# Altium schematic sheet ET-USB.SchDoc
size A4
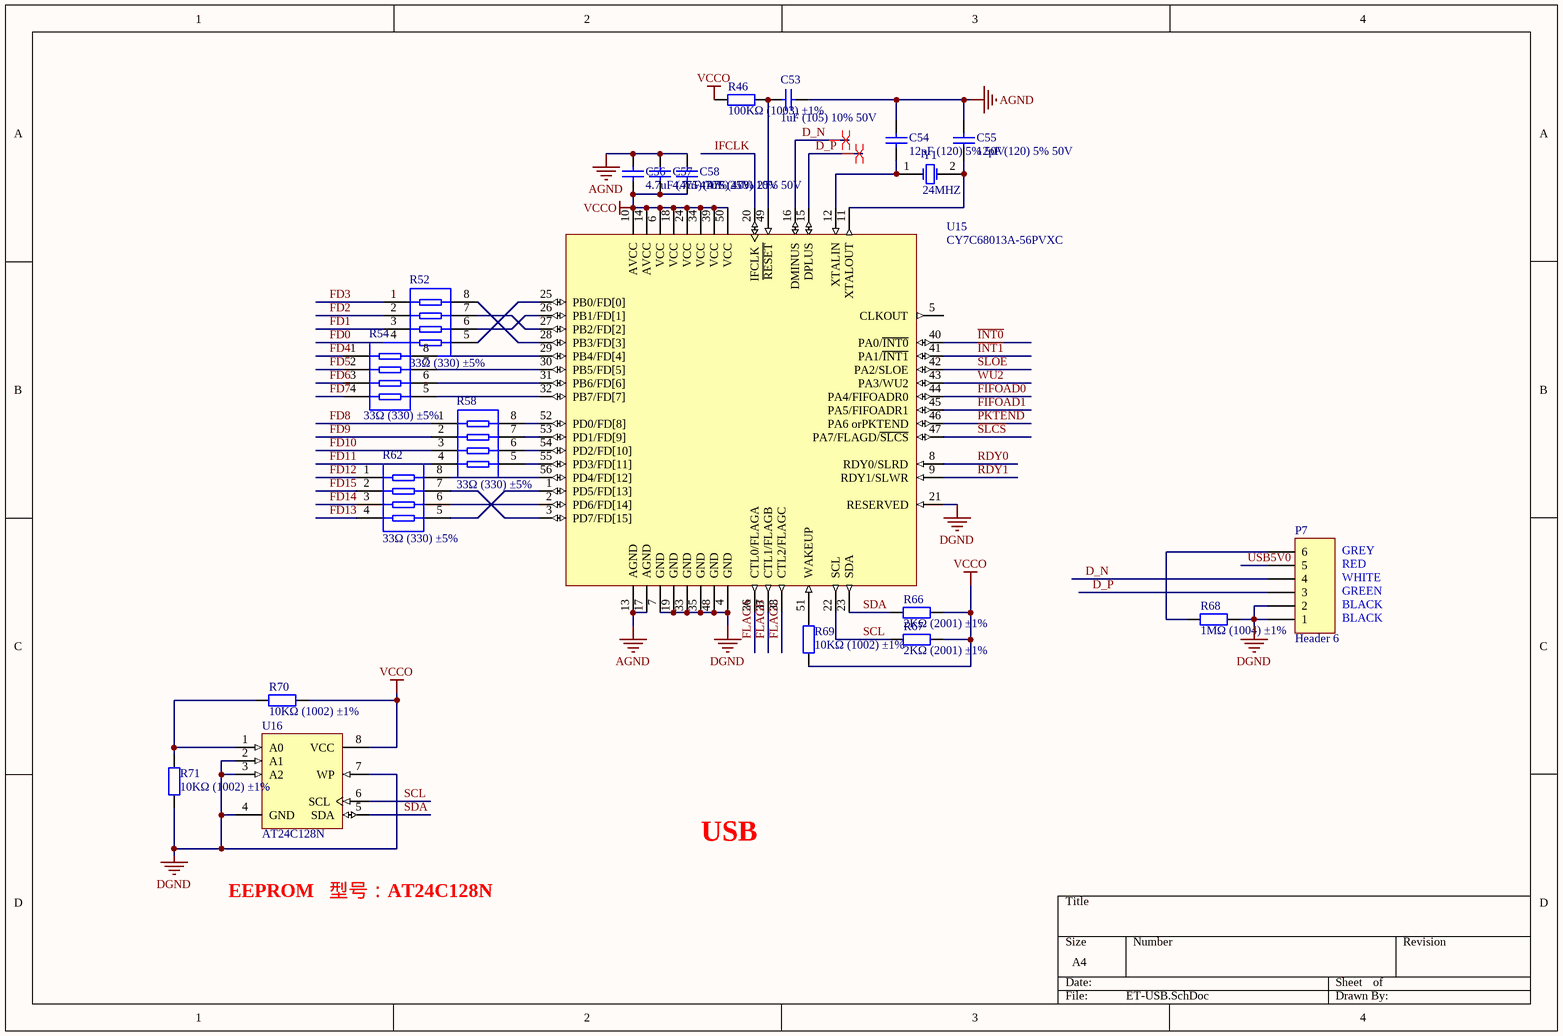
[diagram p0: ET-USB.SchDoc]

## Parts
C53  1uF (105) 10% 50V  [LC-0805_C]
C54  12pF (120) 5% 50V  [LC-0805_C]
C55  12pF (120) 5% 50V  [LC-0805_C]
C56  4.7uF (475) 10% 25V  [LC-0805_C]
C57  4.7uF (475) 10% 25V  [LC-0805_C]
C58  47nF (473) 10% 50V  [LC-0805_C]
P7  Header 6  [HDR1X6]
R46  100KΩ (1003) ±1%  [LC-0805_R]
R52  33Ω (330) ±5%  [LC-0402_Rx4]
R54  33Ω (330) ±5%  [LC-0402_Rx4]
R58  33Ω (330) ±5%  [LC-0402_Rx4]
R62  33Ω (330) ±5%  [LC-0402_Rx4]
R66  2KΩ (2001) ±1%  [LC-0805_R]
R67  2KΩ (2001) ±1%  [LC-0805_R]
R68  1MΩ (1004) ±1%  [LC-0805_R]
R69  10KΩ (1002) ±1%  [LC-0805_R]
R70  10KΩ (1002) ±1%  [LC-0805_R]
R71  10KΩ (1002) ±1%  [LC-0805_R]
U15  CY7C68013A-56PVXC  [O56_N]
U16  AT24C128N  [8P3]
Y1  24MHZ  [XTAL5]

## Nets
AGND: C53.2 C54.2 C55.2 C56.2 C57.2 C58.2 U15.13(AGND) U15.17(AGND)
DGND: P7.1 P7.2 R68.2 R71.1 U15.4(GND) U15.7(GND) U15.19(GND) U15.21(RESERVED) U15.33(GND) U15.35(GND) U15.48(GND) U16.2(A1) U16.3(A2) U16.4(GND) U16.7(WP)
VCCO: C56.1 C57.1 C58.1 R46.1 R66.2 R67.2 R69.1 R70.2 U15.6(VCC) U15.10(AVCC) U15.14(AVCC) U15.18(VCC) U15.24(VCC) U15.34(VCC) U15.39(VCC) U15.50(VCC) U16.8(VCC)
~{INT0}: U15.40(PA0/~{INT0})
~{INT1}: U15.41(PA1/~{INT1})
~{SLCS}: U15.47(PA7/FLAGD/~{SLCS})
D_N: P7.4 U15.16(DMINUS)
D_P: P7.3 U15.15(DPLUS)
FD0: R52.4
FD1: R52.3
FD2: R52.2
FD3: R52.1
FD4: R54.1
FD5: R54.2
FD6: R54.3
FD7: R54.4
FD8: R58.1
FD9: R58.2
FD10: R58.3
FD11: R58.4
FD12: R62.1
FD13: R62.4
FD14: R62.3
FD15: R62.2
FIFOAD0: U15.44(PA4/FIFOADR0)
FIFOAD1: U15.45(PA5/FIFOADR1)
FLAGA: U15.36(CTL0/FLAGA)
FLAGB: U15.37(CTL1/FLAGB)
FLAGC: U15.38(CTL2/FLAGC)
IFCLK: U15.20(IFCLK)
PKTEND: U15.46(PA6_orPKTEND)
RDY0: U15.8(RDY0/SLRD)
RDY1: U15.9(RDY1/SLWR)
SCL: R67.1 U15.22(SCL) U16.6(SCL)
SDA: R66.1 U15.23(SDA) U16.5(SDA)
SLOE: U15.42(PA2/SLOE)
USB5V0: P7.5
WU2: U15.43(PA3/WU2)
NetC53_1: C53.1 R46.2 U15.49(~{RESET})
NetC54_1: C54.1 U15.12(XTALIN) Y1.1(OSC1)
NetC55_1: C55.1 U15.11(XTALOUT) Y1.2(OSC2)
NetP7_6: P7.6 R68.1
NetR52_5: R52.5 U15.25(PB0/FD[0])
NetR52_6: R52.6 U15.26(PB1/FD[1])
NetR52_7: R52.7 U15.27(PB2/FD[2])
NetR52_8: R52.8 U15.28(PB3/FD[3])
NetR54_5: R54.5 U15.32(PB7/FD[7])
NetR54_6: R54.6 U15.31(PB6/FD[6])
NetR54_7: R54.7 U15.30(PB5/FD[5])
NetR54_8: R54.8 U15.29(PB4/FD[4])
NetR58_5: R58.5 U15.55(PD3/FD[11])
NetR58_6: R58.6 U15.54(PD2/FD[10])
NetR58_7: R58.7 U15.53(PD1/FD[9])
NetR58_8: R58.8 U15.52(PD0/FD[8])
NetR62_5: R62.5 U15.1(PD5/FD[13])
NetR62_6: R62.6 U15.2(PD6/FD[14])
NetR62_7: R62.7 U15.3(PD7/FD[15])
NetR62_8: R62.8 U15.56(PD4/FD[12])
NetR69_2: R69.2 U15.51(WAKEUP)
NetR70_1: R70.1 R71.2 U16.1(A0)

Not connected (* = marked no-connect by the designer): U15 5(CLKOUT)

## Layout directives
differential pair: D_N, D_P

## Notes on the sheet
- USB
- EEPROM   型号：AT24C128N
- Labels drawn without touching a wire or pin: BLACK, GREEN, GREY, RED, WHITE

## Library data of the parts
C53 = 0805 1uF (105) 10% 50V: 贴片电容; ComponentLink1Description: 供应商链接; ComponentLink1URL: http://www.szlcsc.com/product/details_29074.html; Package: 0805; Supplier: LC; SuppliersPartNumber: C28323
C54 C55 = 0805 12pF (120) 5% 50V: 贴片电容; ComponentLink1Description: 供应商链接; ComponentLink1URL: http://www.szlcsc.com/product/details_2144.html; Package: 0805; Supplier: LC; SuppliersPartNumber: C1792
C56 C57 = 0805 4.7uF (475) 10% 25V: 贴片电容; ComponentLink1Description: 供应商链接; ComponentLink1URL: http://www.szlcsc.com/product/details_2131.html; Package: 0805; Supplier: LC; SuppliersPartNumber: C1779
C58 = 0805 47nF (473) 10% 50V: 贴片电容; ComponentLink1Description: 供应商链接; ComponentLink1URL: http://www.szlcsc.com/product/details_54150.html; Package: 0805; Supplier: LC; SuppliersPartNumber: C53134
P7 = Header 6: Header, 6-Pin; LatestRevisionDate: 17-Jul-2002; LatestRevisionNote: Re-released for DXP Platform.; Publisher: Altium Limited
R46 = 0805 100KΩ (1003) 1%: 贴片电阻; ComponentLink1Description: 供应商链接; ComponentLink1URL: http://www.szlcsc.com/product/details_18095.html; Package: 0805; Supplier: LC; SuppliersPartNumber: C17407
R52 R54 R58 R62 = 0402*4 33Ω (330) 5%: 贴片排阻; ComponentLink1Description: 供应商链接; ComponentLink1URL: http://www.szlcsc.com/product/details_26244.html; Package: 0402*4; Supplier: LC; SuppliersPartNumber: C25501
R66 R67 = 0805 2KΩ (2001) 1%: 贴片电阻; ComponentLink1Description: 供应商链接; ComponentLink1URL: http://www.szlcsc.com/product/details_18292.html; Package: 0805; Supplier: LC; SuppliersPartNumber: C17604
R68 = 0805 1MΩ (1004) 1%: 贴片电阻; ComponentLink1Description: 供应商链接; ComponentLink1URL: http://www.szlcsc.com/product/details_18202.html; Package: 0805; Supplier: LC; SuppliersPartNumber: C17514
R69-R71 = 0805 10KΩ (1002) 1%: 贴片电阻; ComponentLink1Description: 供应商链接; ComponentLink1URL: http://www.szlcsc.com/product/details_18102.html; Package: 0805; Supplier: LC; SuppliersPartNumber: C17414
U15 = CY7C68013A-56PVXC: EZ-USB FX2LP USB Microcontroller Ideal for Non-Battery Powered Applications,16K RAM, 24 I/Os, 56-Pin SSOP, Pb-Free, Commercial Grade; Published: 16-Dec-2005; LatestRevisionDate: 20-Nov-2009; LatestRevisionNote: IPC-7351 Footprint Added.; DatasheetVersion: rev.J, Sep-2005; PackageVersion: Feb-2005; PackageReference: O56; Publisher: Altium Limited; PackageDescription: 56-Pin Small Outline Package 0.635 mm Pitch; Code_JEDEC: MO-118-AB; Code_IPC: SOP635P1035-56; ComponentLink1Description: Manufacturer Link; ComponentLink1URL: http://www.cypress.com/portal/server.pt; ComponentLink2Description: Datasheet; ComponentLink2URL: http://www.cypress.com/portal/server.pt/gateway/PTARGS_0_2_1524_209_259_43/http%3B/sjapp20.mis.cypress.com%3B7001/publishedcontent/publish/design_resources/datasheets/contents/cy7c68013a_5.pdf
U16 = AT24C01BN-SP25-B: 1Kbit (128 x 8), 2-wire Bus Automotive Serial EEPROM with Write Protect, 2.5V, 8-Pin SOIC, Bulk; Published: 20-Sep-2010; DatasheetVersion: 8517C,  Jan-2009; PackageVersion: revC, Mar-2005; PackageReference: 8S1; Publisher: Altium Limited; PackageDescription: 8-Lead (0.150" Wide Body), Plastic Gull Wing Small Outline (JEDEC SOIC); Code_JEDEC: MS-012-AA; Code_IPC: SOIC127P600-8; ComponentLink1Description: Manufacturer Link; ComponentLink1URL: http://www.atmel.com/products/serial/default.asp; ComponentLink2Description: Datasheet; ComponentLink2URL: http://www.atmel.com/dyn/resources/prod_documents/doc8517.pdf; ComponentLink3Description: Atmel.com Home; ComponentLink3URL: http://www.atmel.com
Y1 = XTAL: Crystal Oscillator; Published: 8-Jun-2000; LatestRevisionDate: 17-Jul-2002; LatestRevisionNote: Re-released for DXP Platform.; PackageReference: R38; Publisher: Altium Limited